# Altium schematic sheet power.SchDoc
size A4
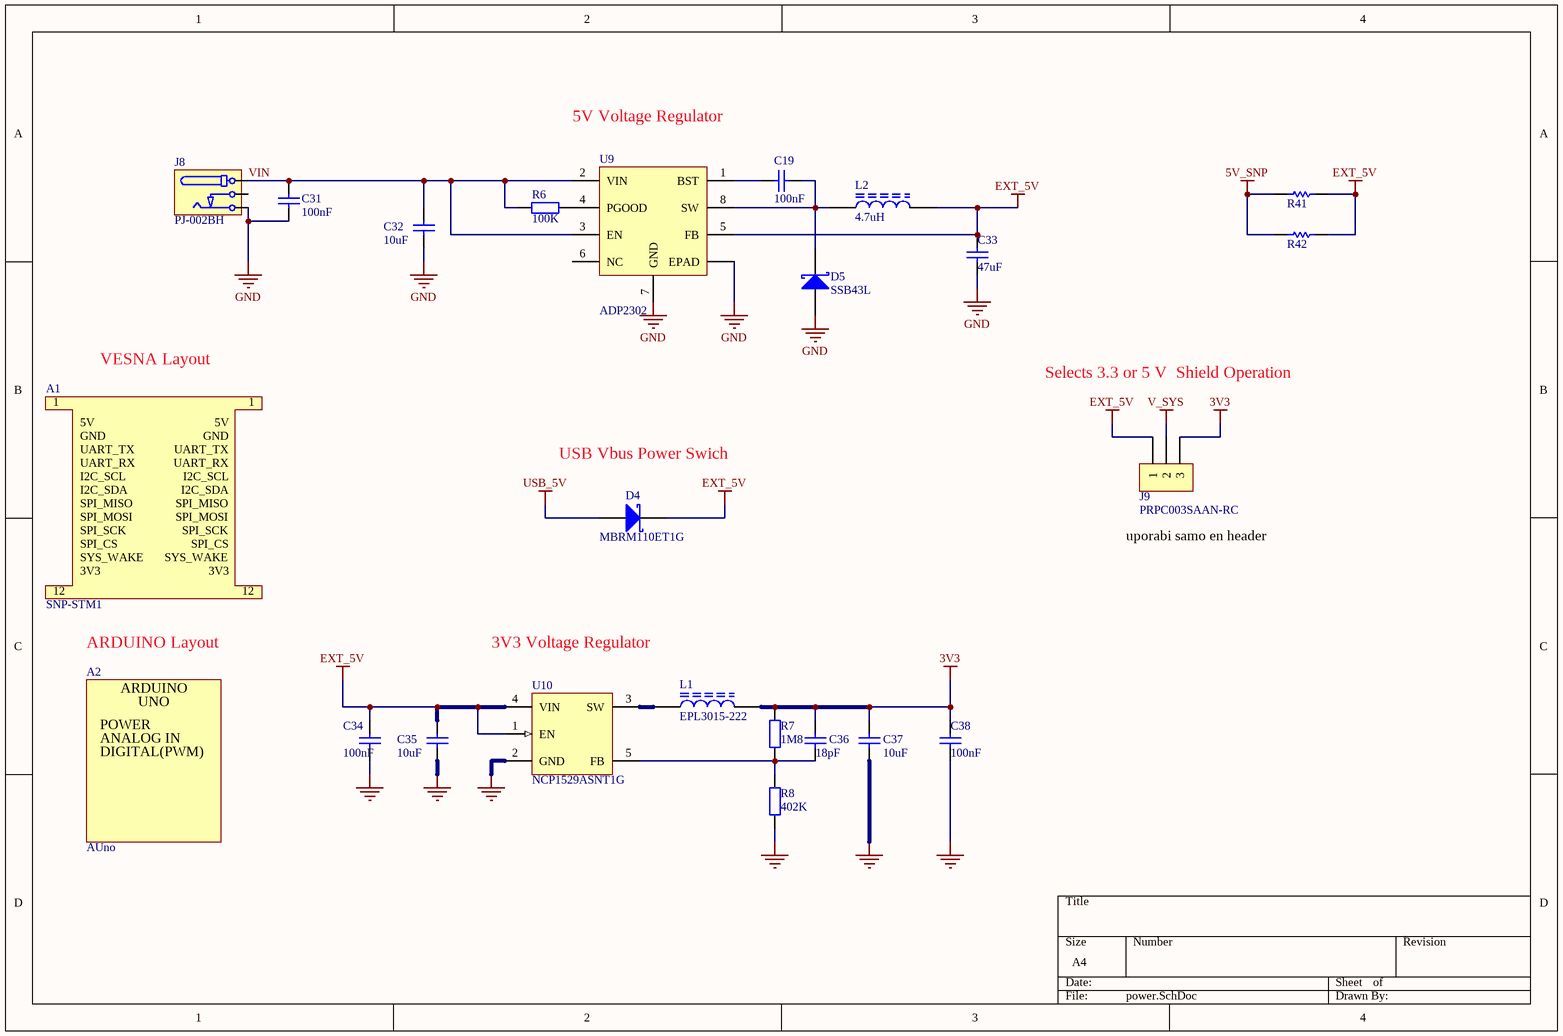
[diagram p0: power.SchDoc]

## Parts
A1  SNP-STM1  [SNP-STM1]  (no BOM)
A2  AUno  [PCBComponent_1]
C19  value 100nF  [CAPC0402(1005)60_L]  (hidden comment: CAP 100nF 10V 0402(1005))
C31  value 100nF  [CAPC0402(1005)60_M]  (hidden comment: CAP 100nF 50V 0402(1005))
C32  10uF  [CAPC0805(2012)145_N]
C33  value 47uF  [CAPC0402(1005)60_M]  (hidden comment: CAP 100nF 50V 0402(1005))
C34  value 100nF  [CAPC0402(1005)60_M]  (hidden comment: CAP 100nF 50V 0402(1005))
C35  10uF  [CAPC0805(2012)145_N]
C36  value 18pF  [CAPC0402(1005)60_M]  (hidden comment: CAP 18pF 50V 0402(1005))
C37  10uF  [CAPC0805(2012)145_N]
C38  value 100nF  [CAPC0402(1005)60_M]  (hidden comment: CAP 100nF 50V 0402(1005))
D4  MBRM110ET1G  [CASE 457–04]
D5  SSB43L  [CASE 457–04]
J8  PJ-002BH  [PJ-002BH]
J9  PRPC003SAAN-RC  [PRPC003SAAN-RC]
L1  EPL3015-222  [EPL3015-222_L]
L2  4.7uH  [EPL3015-222_L]
R6  value 100K  [RESC0402(1005)_M]  (hidden comment: 100K 1% 0402(1005))
R7  value 1M8  [RESC0402(1005)_L]  (hidden comment: 1M8 1% 0402(1005))
R8  value 402K  [RESC0402(1005)_L]  (hidden comment: 402K 1% 0402(1005))
R41  Jumper 0805(2012)  [RESC0805(2012)_N]  (value not drawn)
R42  Jumper 0805(2012)  [RESC0805(2012)_N]  (value not drawn)
U9  ADP2302  [SOP127P600-8N]
U10  NCP1529ASNT1G  [SOT-23-5_L]

## Nets
3V3: C36.2 C37.2 C38.2 J9.3 L1.2 R7.2
5V_SNP: R41.1 R42.1
EXT_5V: C33.2 C34.2 C35.2 D4.1(K) J9.1 L2.2 R41.2 R42.2 U9.5(FB) U10.1(EN) U10.4(VIN)
GND: C31.2 C32.1 C33.1 C34.1 C35.1 C37.1 C38.1 D5.2(A) J8.2(T) R8.1 U9.7(GND) U9.9(EPAD) U10.2(GND)
USB_5V: D4.2(A)
V_SYS: J9.2
VIN: C31.1 C32.2 J8.1(S) R6.1 U9.2(VIN) U9.3(EN)
NetC19_1: C19.1 U9.1(BST)
NetC19_2: C19.2 D5.1(K) L2.1 U9.8(SW)
NetC36_1: C36.1 R7.1 R8.2 U10.5(FB)
NetL1_1: L1.1 U10.3(SW)
NetR6_2: R6.2 U9.4(PGOOD)

Not connected (* = marked no-connect by the designer): J8 3(R); U9 6(NC)

## Notes on the sheet
- 5V Voltage Regulator
- VESNA Layout
- Selects 3.3 or 5 V  Shield Operation
- USB Vbus Power Swich
- uporabi samo en header
- ARDUINO Layout
- 3V3 Voltage Regulator
- (in symbol AUno) ARDUINO; UNO; POWER; ANALOG IN; DIGITAL(PWM)
- (in symbol SNP-STM1) 1; 5V; GND; UART_TX; UART_RX; I2C_SCL; I2C_SDA; SPI_MISO; SPI_MOSI; SPI_SCK; SPI_CS; SYS_WAKE; 3V3; 12

## Library data of the parts
A1 = SNP-STM1: SNP-STM1 Vesna Processor Module, Mechanical PCB Components without Connectors
C19 = CMP-1034-02064-1: CAP 100nF 10V ±5% 0402 (1005 Metric) Thickness 0.6mm SMD; Tolerance: Â±5%; Case-EIA: 0402; Case-Metric: 1005; Max Thickness: 0.6 mm; Rated Voltage: 10 V; Technology: SMT
C31 C33 C34 C38 = CMP-1034-02077-1: CAP 100nF 50V ±10% 0402 (1005 Metric) Thickness 0.6mm SMD; Case-Metric: 1005; Case-EIA: 0402; Rated Voltage: 50 V; Technology: SMT; Tolerance: ±10%; Max Thickness: 0.6 mm
C32 C35 C37 = CMP-1036-04924-1: CAP 10uF 10V ±20% 0805 (2012 Metric) Thickness 1.45mm SMD; Case-EIA: 0805; Case-Metric: 2012; Rated Voltage: 10 V; Max Thickness: 1.45 mm; Value: 10uF; Technology: SMT; Tolerance: ±20%
C36 = CMP-1034-00862-1: CAP 18pF 50V ±1% 0402 (1005 Metric) Thickness 0.6mm SMD; Case-Metric: 1005; Case-EIA: 0402; Tolerance: ±1%; Max Thickness: 0.6 mm; Technology: SMT; Rated Voltage: 50 V
D4 D5 = MBRM110ET1G: Diode, Schottky Power Rectifier, SMT, 1A, 10V; Supplier 1: Farnell; Supplier 2: Digi-Key; Supplier 3: Mouser; Supplier Part Number 1: 2369429; Supplier Part Number 2: MBRM110ET1GOSCT-ND; Supplier Part Number 3: 863-MBRM110ET1G
J9 = PRPC003SAAN-RC: Pin header male 3 pin  Through Hole Vertical, Pitch 2.54 mm; Supplier Part Number 1: *; Supplier Part Number 2: S1011EC-40-ND; Supplier Part Number 3: *; Supplier 1: Farnell; Supplier 2: Digi-key; Supplier 3: Mouser
L1 = EPL3015-222: Shielded Power Inductors, 2.2uH, Isat 1.6A @ 30%, Irms 2A @ 40°C, 3 x 3 x 1.5mm; Supplier 1: Farnell; Supplier 2: Mouser; Supplier Part Number 1: 2287410; Supplier Part Number 2: 994-EPL3015-222MLB
L2 = EPL3015-472MLB: Shielded Power Inductors, 4.7uH, Isat 1.6A @ 30%, Irms 1.4A @ 40°C, 3 x 3 x 1.5mm; Manufacturer: COILCRAFT; Supplier 1: Farnell; Supplier 2: Mouser; Supplier Part Number 1: 2287412; Supplier Part Number 2: 994-EPL3015-472MLB; ComponentLink1URL: http://www.farnell.com/datasheets/1681919.pdf; ComponentLink1Description: Datasheet; Manufacturer Part Number: EPL3015-472MLB; Supplier 3: *; Supplier Part Number 3: *
R6 = 100K 0402(1005): 100K 0.063W 1% 0402 (1005 Metric)  SMD; Case-EIA: 0402; Case-Metric: 1005; Power: 0.063W; Technology: SMT; Tolerance: 1%
R7 = 1M8 0402(1005): 1M8 0.063W 1% 0402 (1005 Metric)  SMD; Case-EIA: 0402; Case-Metric: 1005; Power: 0.063W; Technology: SMT; Tolerance: 1%
R8 = 402K 0402(1005): 402K 0.063W 1% 0402 (1005 Metric)  SMD; Case-EIA: 0402; Case-Metric: 1005; Power: 0.063W; Technology: SMT; Tolerance: 1%
R41 R42 = CMP-1013-00001-1: Jumper 0805 (2012 Metric); Case-EIA: 0805; Value: 0.00 Ohm; Tolerance: None; Case-Metric: 2012; Technology: SMT; Power: None
U10 = NCP1529A: 1 A, 1.7 MHz Low Voltage Buck Converter; Supplier 1: Farnell; Supplier 2: Digi-Key; Supplier 3: Mouser; Supplier Part Number 1: 2112613; Supplier Part Number 2: NCP1529ASNT1GOSCT-ND; Supplier Part Number 3: 863-NCP1529ASNT1G
J8 = PJ-002BH: Supplier Part Number 2: CP-002BH-ND; Supplier 2: Digi-Key; Supplier Part Number 3: 490-PJ-002BH; Supplier Part Number 1: *; Supplier 1: Farnell; Supplier 3: Mouser
U9 = ADP2302: Supplier 1: Farnell; Supplier 2: Digi-Key; Supplier 3: Maouser; Supplier Part Number 3: 584-ADP2302ARDZ5.0R7; Supplier Part Number 2: ADP2302ARDZ-5.0-R7TR-ND; Supplier Part Number 1: *